# Altium schematic sheet 01_Block_Diagram.SchDoc
size A; SheetNumber: 1; SheetTotal: 8
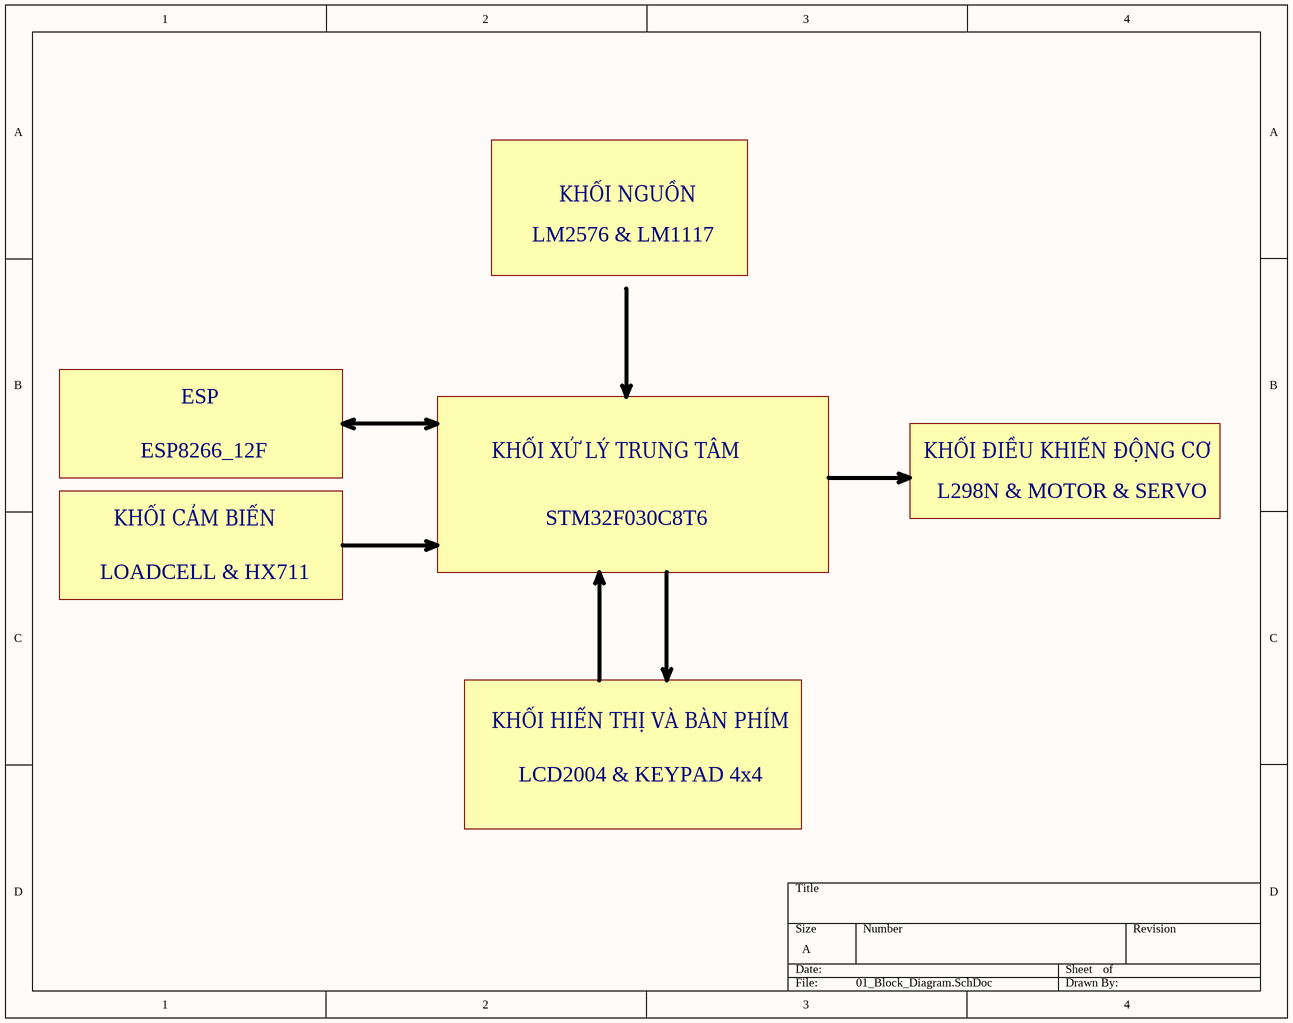
[diagram p0: 01_Block_Diagram.SchDoc]

## Notes on the sheet
- KHỐI NGUỒN
- LM2576 & LM1117
- ESP
- ESP8266_12F
- KHỐI XỬ LÝ TRUNG TÂM
- KHỐI ĐIỀU KHIỂN ĐỘNG CƠ
- L298N & MOTOR & SERVO
- KHỐI CẢM BIẾN
- STM32F030C8T6
- LOADCELL & HX711
- KHỐI HIỂN THỊ VÀ BÀN PHÍM
- LCD2004 & KEYPAD 4x4